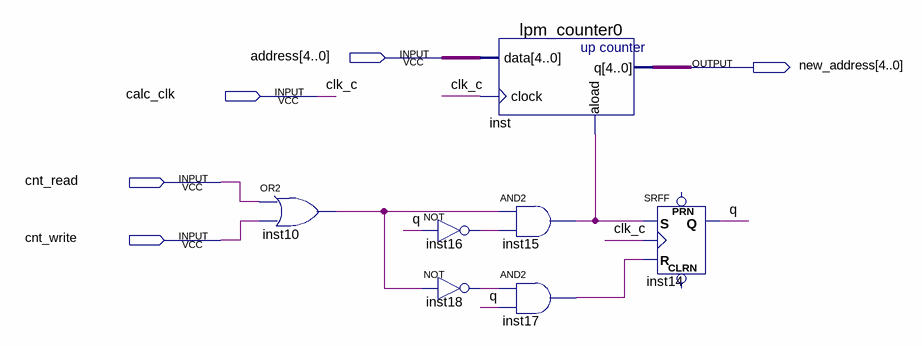
[diagram p0: schematic sheet]
// Quartus schematic address_calculate.bdf as structural Verilog: 7 symbols, 5 pins
module address_calculate (
  input  [4:0] address,
  input  calc_clk,
  input  cnt_read,
  input  cnt_write,
  output [4:0] new_address
);

  wire inst10_out, inst15_out, inst16_out, inst17_out, inst18_out, q;

  or inst10 (inst10_out, cnt_read, cnt_write);
  lpm_counter0 inst (.data(address), .clock(calc_clk), .aload(inst15_out), .q(new_address));
  not inst16 (inst16_out, q);
  not inst18 (inst18_out, inst10_out);
  and inst15 (inst15_out, inst10_out, inst16_out);
  and inst17 (inst17_out, inst18_out, q);
  SRFF inst14 (.S(inst15_out), .R(inst17_out), .CLK(calc_clk), .Q(q));  // open: PRN, CLRN

  // Other names for the same wires on the sheet: clk_c = calc_clk
endmodule
